# Altium schematic sheet lab2_larionov_buck.SchDoc: =title_line_1 + title_line_2
size 594 x 420 mm; SheetNumber: 1
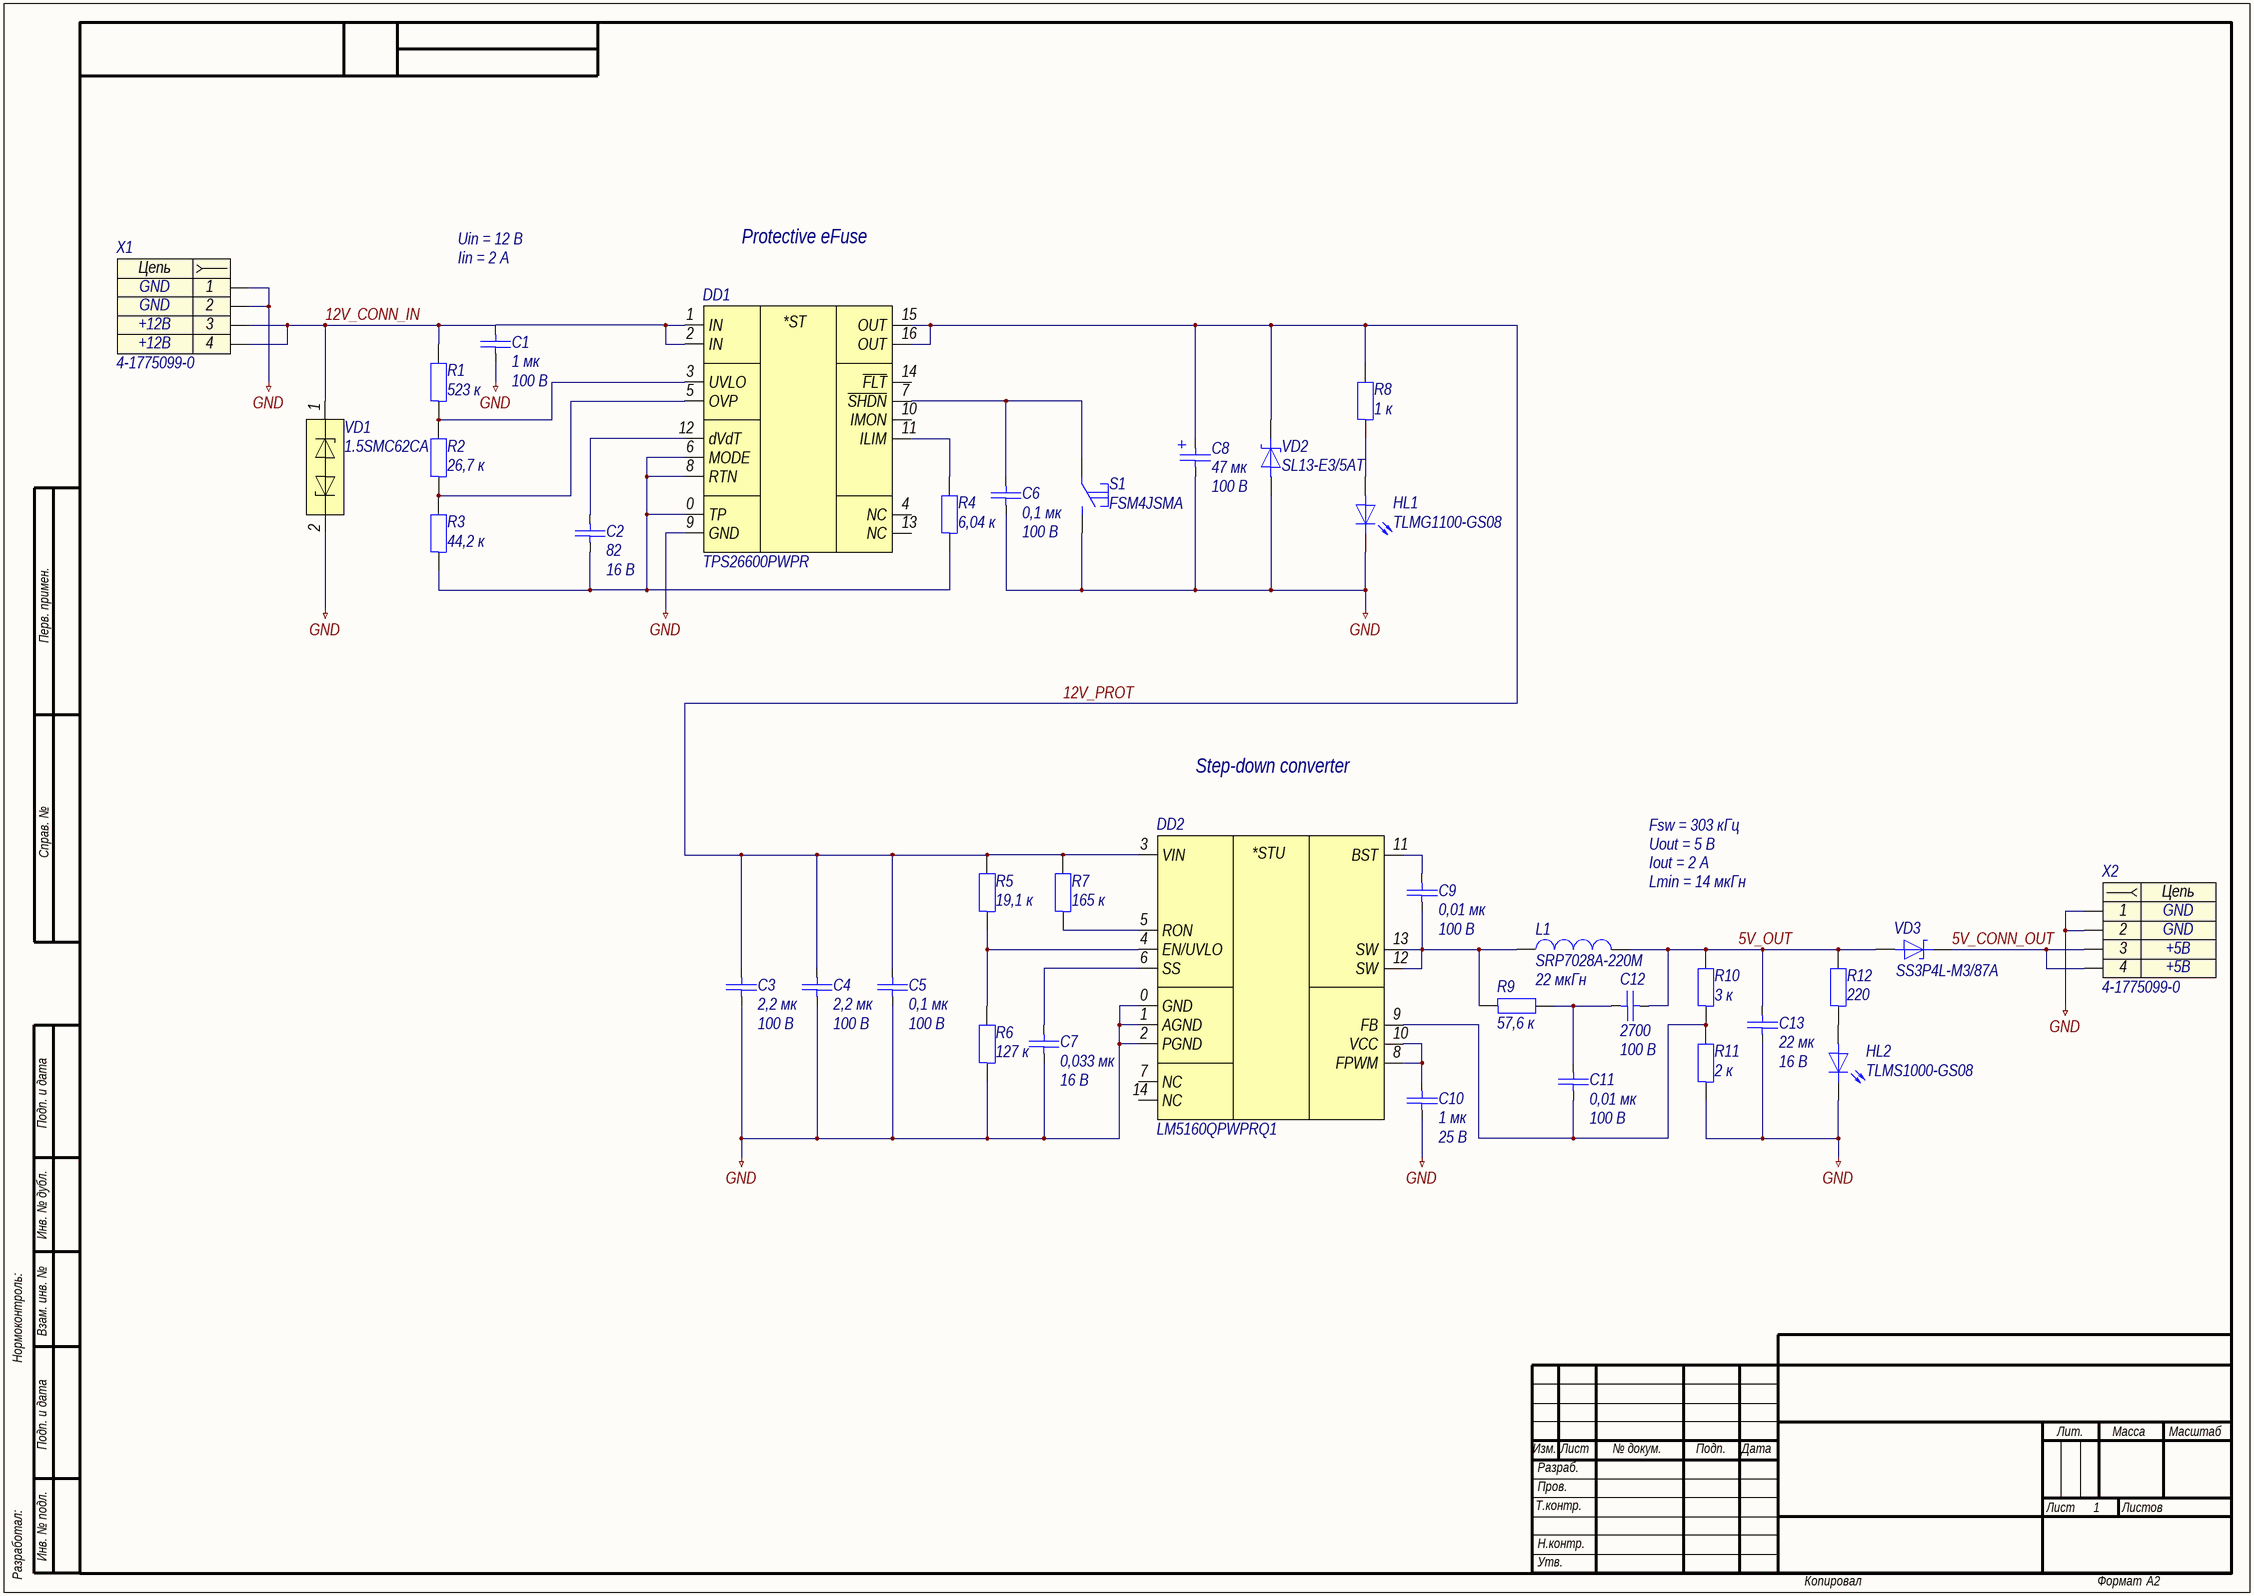
[diagram p0: lab2_larionov_buck.SchDoc]

## Parts
C1  1 мк  Напряжение: 100 В  [C1206]
C2  82  Напряжение: 16 В  [C0603]
C3  2,2 мк  Напряжение: 100 В  [C1206]
C4  2,2 мк  Напряжение: 100 В  [C1206]
C5  0,1 мк  Напряжение: 100 В  [C0603]
C6  0,1 мк  Напряжение: 100 В  [C0603]
C7  0,033 мк  Напряжение: 16 В  [C0603]
C8  47 мк  Напряжение: 100 В  [CAPAE-1000X1000X1200]
C9  0,01 мк  Напряжение: 100 В  [C0603]
C10  1 мк  Напряжение: 25 В  [C0603]
C11  0,01 мк  Напряжение: 100 В  [C0603]
C12  2700  Напряжение: 100 В  [C0603]
C13  22 мк  Напряжение: 16 В  [C1206]
DD1  TPS26600PWPR  [HTSSOP-16]
DD2  LM5160QPWPRQ1  [HTSSOP-14]
HL1  TLMG1100-GS08  [HL0603]
HL2  TLMS1000-GS08  [HL0603]
L1  SRP7028A-220M  Индуктивность: 22 мкГн  [SRP-2-670X660X280]
R1  523 к  [R0603]
R2  26,7 к  [R0603]
R3  44,2 к  [R0603]
R4  6,04 к  [R0603]
R5  19,1 к  [R0603]
R6  127 к  [R0603]
R7  165 к  [R0603]
R8  1 к  [R1218]
R9  57,6 к  [R0603]
R10  3 к  [R0603]
R11  2 к  [R0603]
R12  220  [R0603]
S1  FSM4JSMA  [FSM4JSMA]
VD1  1.5SMC62CA  [DO-214AB]
VD2  SL13-E3/5AT  [DO-214AC]
VD3  SS3P4L-M3/87A  [TO-277A]
X1  4-1775099-0  [4-1775099-0]
X2  4-1775099-0  [4-1775099-0]

## Nets
GND: C1.2 C3.2 C4.2 C5.2 C6.2 C7.2 C8.2 C10.2 C13.2 DD1.9(GND) DD2.0(GND) DD2.1(AGND) DD2.2(PGND) HL1.1 HL2.1 R6.1 R11.1 S1.2 VD1.2 VD2.2 X1.1 X1.2 X2.1 X2.2
5V_CONN_OUT: VD3.1 X2.3 X2.4
5V_OUT: C12.1 C13.1 L1.2 R10.2 R12.2 VD3.2
12V_CONN_IN: C1.1 DD1.1(IN) DD1.2(IN) R1.2 VD1.1 X1.3 X1.4
12V_PROT: C3.1 C4.1 C5.1 C8.1 DD1.15(OUT) DD1.16(OUT) DD2.3(VIN) R5.2 R7.2 R8.2 VD2.1
NetC2_1: C2.1 DD1.12(dVdT)
NetC2_2: C2.2 DD1.0(TP) DD1.6(MODE) DD1.8(RTN) R3.1 R4.1
NetC6_1: C6.1 DD1.7(~{SHDN}) S1.1
NetC7_1: C7.1 DD2.6(SS)
NetC9_1: C9.1 DD2.11(BST)
NetC9_2: C9.2 DD2.12(SW) DD2.13(SW) L1.1 R9.1
NetC10_1: C10.1 DD2.8(FPWM) DD2.10(VCC)
NetC11_1: C11.1 C12.2 R9.2
NetC11_2: C11.2 DD2.9(FB) R10.1 R11.2
NetDD1_3: DD1.3(UVLO) R1.1 R2.2
NetDD1_5: DD1.5(OVP) R2.1 R3.2
NetDD1_11: DD1.11(ILIM) R4.2
NetDD2_4: DD2.4(EN/UVLO) R5.1 R6.2
NetDD2_5: DD2.5(RON) R7.1
NetHL1_2: HL1.2 R8.1
NetHL2_2: HL2.2 R12.1

Not connected (* = marked no-connect by the designer): DD1 4(NC) 10(IMON) 13(NC) 14(~{FLT}); DD2 7(NC) 14(NC)

## Notes on the sheet
- Uin = 12 В
- Iin = 2 А
- Protective eFuse
- Step-down converter
- Fsw = 303 кГц
- Uout = 5 В
- Iout = 2 А
- Lmin = 14 мкГн
- Перв. примен.
- Справ. №
- Подп. и дата
- Инв. № дубл.
- Нормоконтроль:
- Взам. инв. №
- Изм.
- Лист
- № докум.
- Подп.
- Дата
- Лит.
- Масса
- Масштаб
- Т.контр.
- Пров.
- Разраб.
- Листов
- Разработал:
- Инв. № подл.
- Н.контр.
- Утв.
- Копировал
- Формат
- А2
- (in symbol dd0001) *ST
- (in symbol dd0003) *STU
- (in symbol x0004) Цепь

## Library data of the parts
C1 = c0068: =Описание; ID: c0068; Фамилия: Ларионов; Описание: Конденсатор чип 1206 1 мкФ 100 В ±10 %; Наименование: CC1206KKX7R0BB105; Производитель: YAGEO Corp.; Отклонение: ±10 %; Рабочие температуры: от –55 °С до +125 °С; Температурный коэффициент емкости: X7R; Корпус: 1206; Номинал: 1 мк; Номинальное напряжение: 100 В; HelpURL: https://www.yageo.com/upload/media/product/productsearch/datasheet/mlcc/UPY-NP0X7R_MV_100-to-630V_22.pdf
C2 = c0011: =Описание; ID: c0011; Фамилия: Ларионов; Описание: Конденсатор чип 0603 82 пФ 16 В ±5 %; Наименование: CC0603JRNPO7BN820; Производитель: YAGEO Corp.; Отклонение: ±5 %; Рабочие температуры: от –55 °С до +125 °С; Температурный коэффициент емкости: C0G; Корпус: 0603; Номинал: 82; Номинальное напряжение: 16 В; HelpURL: https://www.yageo.com/upload/media/product/productsearch/datasheet/mlcc/UPY-GP_NP0_16V-to-50V_18.pdf
C3 C4 = c0078: =Описание; ID: c0078; Фамилия: Ларионов; Описание: Конденсатор чип 1206 2,2 мкФ 100 В ±10 %; Наименование: CC1206KKX7R0BB225; Производитель: YAGEO Corp.; Отклонение: ±10 %; Рабочие температуры: от –55 °С до +125 °С; Температурный коэффициент емкости: X7R; Корпус: 1206; Номинал: 2,2 мк; Номинальное напряжение: 100 В; HelpURL: https://www.yageo.com/upload/media/product/productsearch/datasheet/mlcc/UPY-NP0X7R_MV_100-to-630V_22.pdf
C5 C6 = c0038: =Описание; ID: c0038; Фамилия: Ларионов; Описание: Конденсатор чип 0603 100 нФ 100 В ±10 %; Наименование: CC0603KRX7R0BB104; Производитель: YAGEO Corp.; Отклонение: ±10 %; Рабочие температуры: от –55 °С до +125 °С; Температурный коэффициент емкости: X7R; Корпус: 0603; Номинал: 0,1 мк; Номинальное напряжение: 100 В; HelpURL: https://www.yageo.com/upload/media/product/productsearch/datasheet/mlcc/UPY-NP0X7R_MV_100-to-630V_22.pdf
C7 = c0027: =Описание; ID: c0027; Фамилия: Ларионов; Описание: Конденсатор чип 0603 33 нФ 16 В ±5 %; Наименование: CC0603JPX7R7BB333; Производитель: YAGEO Corp.; Отклонение: ±5 %; Рабочие температуры: от –55 °С до +125 °С; Температурный коэффициент емкости: X7R; Корпус: 0603; Номинал: 0,033 мк; Номинальное напряжение: 16 В; HelpURL: https://www.yageo.com/upload/media/product/productsearch/datasheet/mlcc/UPY-GPHC_X7R_6.3V-to-50V_20.pdf
C8 = c0118: =Описание; ID: c0118; Фамилия: Ларионов; Описание: Конденсатор электролитический 47 мкФ 100 В ±20 %; Наименование: MAL214699904E3; Производитель: Vishay Intertechnology, Inc.; Отклонение: ±20 %; Рабочие температуры: от –55 °С до +125 °С; Корпус: CAPAE (10 x 10 x 12); Номинал: 47 мк; Номинальное напряжение: 100 В; Температурный коэффициент емкости: -; HelpURL: https://www.vishay.com/capacitors/list/product-28403/
C9 C11 = c0022: =Описание; ID: c0022; Фамилия: Ларионов; Описание: Конденсатор чип 0603 10 нФ 100 В ±5 %; Наименование: CC0603JRX7R0BB103; Производитель: YAGEO Corp.; Отклонение: ±5 %; Рабочие температуры: от –55 °С до +125 °С; Температурный коэффициент емкости: X7R; Корпус: 0603; Номинал: 0,01 мк; Номинальное напряжение: 100 В; HelpURL: https://www.yageo.com/upload/media/product/productsearch/datasheet/mlcc/UPY-NP0X7R_MV_100-to-630V_22.pdf
C10 = c0017: =Описание; ID: c0017; Фамилия: Ларионов; Описание: Конденсатор чип 0603 1 мкФ 25 В ±10 %; Наименование: CC0603KRX7R8BB105; Производитель: YAGEO Corp.; Отклонение: ±10 %; Рабочие температуры: от -55 °С до +125 °С; Корпус: 0603; Номинал: 1 мк; Номинальное напряжение: 25 В; HelpURL: https://www.yageo.com/upload/media/product/products/datasheet/mlcc/UPY-GPHC_X7R_6.3V-to-50V_20.pdf
C12 = c0021: =Описание; ID: c0021; Фамилия: Ларионов; Описание: Конденсатор чип 0603 2,7 нФ 100 В ±10 %; Наименование: CC0603KRX7R0BB272; Производитель: YAGEO Corp.; Отклонение: ±10 %; Рабочие температуры: от –55 °С до +125 °С; Температурный коэффициент емкости: X7R; Корпус: 0603; Номинал: 2700; Номинальное напряжение: 100 В; HelpURL: https://www.yageo.com/upload/media/product/products/datasheet/mlcc/UPY-GPHC_X7R_6.3V-to-50V_20.pdf
C13 = c0106: =Описание; ID: c0106; Фамилия: Ларионов; Описание: Конденсатор чип 1206 22 мкФ 16 В ±20 %; Наименование: CC1206MKX7R7BB226; Производитель: YAGEO Corp.; Отклонение: ±20 %; Рабочие температуры: от –55 °С до +125 °С; Температурный коэффициент емкости: X7R; Корпус: 1206; Номинал: 22 мк; Номинальное напряжение: 16 В; HelpURL: https://www.yageo.com/upload/media/product/productsearch/datasheet/mlcc/UPY-GPHC_X7R_6.3V-to-50V_20.pdf
DD1 = dd0001: =Описание; ID: dd0001; Фамилия: Ларионов; Описание: Защитная микросхема eFuse 60 В и 2 А; Производитель: Texas Instruments; Напряжение: от 4,2 В до 60 В; Максимальное напряжение: 62 В; Ток: от 0,1 А до 2,23 А; Рабочие температуры: от -40 °С до +125 °С; Наименование: TPS26600PWPR; Корпус: HTSSOP-16; HelpURL: https://www.ti.com/product/TPS2660
DD2 = dd0003: =Описание; ID: dd0003; Фамилия: Ларионов; Описание: Понижающий преобразователь напряжения 65 В и 2 А; Производитель: Texas Instruments; Входное напряжение: от 4,5 В до 65 В; Выходное напряжение: не указано; Коммутируемый ток: до 2 А; Частота переключения: до 1 МГц; Рабочие температуры: от -40 °С до +125 °С; Наименование: LM5160QPWPRQ1; Корпус: HTSSOP-14; HelpURL: https://www.ti.com/product/LM5160-Q1
HL1 = hl0005: =Описание; ID: hl0005; Фамилия: Ларионов; Описание: Светодиод чип 0603 зеленый; Производитель: Vishay Intertechnology, Inc.; Цвет: Green; Номинальная сила света: 35 мкд; Номинальная длина волны: 570 нм; Номинальный прямой ток: 30 мА; Номинальное падение напряжения: 2,1 В; Рассеиваемая мощность: 90 мВт; Рабочие температуры: от -40 °С до +100 °С; Корпус: 0603; Наименование: TLMG1100-GS08; HelpURL: https://www.vishay.com/leds/list/product-83173/
HL2 = hl0001: =Описание; ID: hl0001; Фамилия: Ларионов; Описание: Светодиод чип 0603 красный; Производитель: Vishay Intertechnology, Inc.; Цвет: Red; Номинальная сила света: 4 мкд; Номинальная длина волны: 628 нм; Номинальный прямой ток: 15 мА; Номинальное падение напряжения: 1,8 В; Рассеиваемая мощность: 40 мВт; Рабочие температуры: от -40 °С до +100 °С; Корпус: 0603; Наименование: TLMS1000-GS08; HelpURL: https://www.vishay.com/leds/list/product-83172/
L1 = l0006: =Описание; ID: l0006; Фамилия: Ларионов; Описание: Катушка индуктивности 22 мкГн ±20 %; Производитель: Bourns, Inc.; Отклонение: ±20 %; Номинальное активное сопротивление: 165 мОм; Максимальное активное сопротивление: 190 мОм; Резонансная частота: 10 МГц; Номинальный ток (при нагреве на 20 °С/40 °С): 2 А; Ток насыщения: 3,5 А; Рабочее напряжение: не указано; Рабочие температуры: от –55 °С до +150 °С; Корпус: 6,7 x 6,6 x 2,8; Наименование: SRP7028A-220M; Номинал: 22 мкГн; HelpURL: https://www.bourns.com/products/magnetic-products/power-inductors-aec-q200-compliant/product/SRP7028A
R1 = r0032: =Описание; ID: r0032; Фамилия: Жернаков; Описание: Резистор чип 0603 523 кОм ±1 % 0,1 Вт; Наименование: RC0603FR-07523KL; Производитель: YAGEO Corp.; Отклонение: ±1 %; Номинальное напряжение: 75 В; Рабочие температуры: от -55 °С до +155 °С; Номинальный ток: 1 А; Корпус: 0603; Номинал: 523 к; HelpURL: https://www.yageo.com/upload/media/product/productsearch/datasheet/rchip/PYu-RC_Group_51_RoHS_L_11.pdf
R2 = r0022: =Описание; ID: r0022; Фамилия: Ларионов; Описание: Резистор чип 0603 26,7 кОм ±1 % 0,1 Вт; Наименование: RC0603FR-0726K7L; Производитель: YAGEO Corp.; Отклонение: ±1 %; Номинальное напряжение: 75 В; Рабочие температуры: от -55 °С до +155 °С; Номинальный ток: 1 А; Корпус: 0603; Номинал: 26,7 к; HelpURL: https://www.yageo.com/upload/media/product/productsearch/datasheet/rchip/PYu-RC_Group_51_RoHS_L_11.pdf
R3 = r0023: =Описание; ID: r0023; Фамилия: Ларионов; Описание: Резистор чип 0603 44,2 кОм ±1 % 0,1 Вт; Наименование: RC0603FR-0744K2L; Производитель: YAGEO Corp.; Отклонение: ±1 %; Номинальное напряжение: 75 В; Рабочие температуры: от -55 °С до +155 °С; Номинальный ток: 1 А; Корпус: 0603; Номинал: 44,2 к; HelpURL: https://www.yageo.com/upload/media/product/productsearch/datasheet/rchip/PYu-RC_Group_51_RoHS_L_11.pdf
R4 = r0015: =Описание; ID: r0015; Фамилия: Ларионов; Описание: Резистор чип 0603 6,04 кОм ±1 % 0,1 Вт; Наименование: RC0603FR-076K04L; Производитель: YAGEO Corp.; Отклонение: ±1 %; Номинальное напряжение: 75 В; Рабочие температуры: от -55 °С до +155 °С; Номинальный ток: 1 А; Корпус: 0603; Номинал: 6,04 к; HelpURL: https://www.yageo.com/upload/media/product/productsearch/datasheet/rchip/PYu-RC_Group_51_RoHS_L_11.pdf
R5 = r0020: =Описание; ID: r0020; Фамилия: Ларионов; Описание: Резистор чип 0603 19,1 кОм ±1 % 0,1 Вт; Наименование: RC0603FR-0719K1L; Производитель: YAGEO Corp.; Отклонение: ±1 %; Номинальное напряжение: 75 В; Рабочие температуры: от -55 °С до +155 °С; Номинальный ток: 1 А; Корпус: 0603; Номинал: 19,1 к; HelpURL: https://www.yageo.com/upload/media/product/productsearch/datasheet/rchip/PYu-RC_Group_51_RoHS_L_11.pdf
R6 = r0028: =Описание; ID: r0028; Фамилия: Ларионов; Описание: Резистор чип 0603 127 кОм ±1 % 0,1 Вт; Наименование: RC0603FR-07127KL; Производитель: YAGEO Corp.; Отклонение: ±1 %; Номинальное напряжение: 75 В; Рабочие температуры: от -55 °С до +155 °С; Номинальный ток: 1 А; Корпус: 0603; Номинал: 127 к; HelpURL: https://www.yageo.com/upload/media/product/productsearch/datasheet/rchip/PYu-RC_Group_51_RoHS_L_11.pdf
R7 = r0030: =Описание; ID: r0030; Фамилия: Ларионов; Описание: Резистор чип 0603 165 кОм ±1 % 0,1 Вт; Наименование: RC0603FR-07165KL; Производитель: YAGEO Corp.; Отклонение: ±1 %; Номинальное напряжение: 75 В; Рабочие температуры: от -55 °С до +155 °С; Номинальный ток: 1 А; Корпус: 0603; Номинал: 165 к; HelpURL: https://www.yageo.com/upload/media/product/productsearch/datasheet/rchip/PYu-RC_Group_51_RoHS_L_11.pdf
R8 = r0012: =Описание; ID: r0012; Фамилия: Ларионов; Описание: Резистор чип 1218 1 кОм ±1 % 1 Вт; Наименование: AA1218FK-071KL; Производитель: YAGEO Corp.; Отклонение: ±1 %; Номинальное напряжение: 200 В; Рабочие температуры: от -55 °С до +155 °С; Номинальный ток: 6 А; Корпус: 1218; Номинал: 1 к; HelpURL: https://www.yageo.com/upload/media/product/productsearch/datasheet/rchip/PYu-AA_51_RoHS_L_3.pdf
R9 = r0025: =Описание; ID: r0025; Фамилия: Ларионов; Описание: Резистор чип 0603 57,6 кОм ±1 % 0,1 Вт; Наименование: RC0603FR-0757K6L; Производитель: YAGEO Corp.; Отклонение: ±1 %; Номинальное напряжение: 75 В; Рабочие температуры: от -55 °С до +155 °С; Номинальный ток: 1 А; Корпус: 0603; Номинал: 57,6 к; HelpURL: https://www.yageo.com/upload/media/product/productsearch/datasheet/rchip/PYu-RC_Group_51_RoHS_L_11.pdf
R10 = r0013: =Описание; ID: r0013; Фамилия: Ларионов; Описание: Резистор чип 0603 3 кОм ±1 % 0,1 Вт; Наименование: RC0603FR-073KL; Производитель: YAGEO Corp.; Отклонение: ±1 %; Номинальное напряжение: 75 В; Рабочие температуры: от -55 °С до +155 °С; Номинальный ток: 1 А; Корпус: 0603; Номинал: 3 к; HelpURL: https://www.yageo.com/upload/media/product/productsearch/datasheet/rchip/PYu-RC_Group_51_RoHS_L_11.pdf
R11 = r0013: =Описание; ID: r0013; Фамилия: Ларионов; Описание: Резистор чип 0603 2 кОм ±1 % 0,1 Вт; Наименование: RC0603FR-072KL; Производитель: YAGEO Corp.; Отклонение: ±1 %; Номинальное напряжение: 75 В; Рабочие температуры: от -55 °С до +155 °С; Номинальный ток: 1 А; Корпус: 0603; Номинал: 2 к; HelpURL: https://www.yageo.com/upload/media/product/productsearch/datasheet/rchip/PYu-RC_Group_51_RoHS_L_11.pdf
R12 = r0009: =Описание; ID: r0009; Фамилия: Ларионов; Описание: Резистор чип 0603 220 Ом ±1 % 0,1 Вт; Наименование: RC0603FR-07220RL; Производитель: YAGEO Corp.; Отклонение: ±1 %; Номинальное напряжение: 75 В; Рабочие температуры: от -55 °С до +155 °С; Номинальный ток: 1 А; Корпус: 0603; Номинал: 220; HelpURL: https://www.yageo.com/upload/media/product/productsearch/datasheet/rchip/PYu-RC_Group_51_RoHS_L_11.pdf
S1 = sw0002: =Описание; ID: sw0002; Фамилия: Паньков; Описание: Тактовая кнопка поверхностного монтажа; Производитель: TE Connectivity; Ток нагрузки: 50 мА @ 24 В; Сопротивление контакта: 100 мОм; Количество контактов: 1; Рабочие температуры: от -35 °С до +85 °С; Промывка: Разрешена; Корпус: 6,00x6,00x4,98; Наименование: FSM4JSMA; HelpURL: https://www.te.com/usa-en/product-4-1437565-1.html
VD1 = vd0004: =Описание; ID: vd0004; Фамилия: Ларионов; Описание: Двунаправленная диодная сборка для подавления помех, 53 В; Производитель: Littelfuse, Inc.; Наименование: 1.5SMC62CA; Корпус: DO-214AB; HelpURL: https://www.littelfuse.com/products/tvs-diodes/surface-mount/1_5smc.aspx
VD2 = vd0001: =Описание; ID: vd0001; Фамилия: Ларионов; Описание: Диод Шоттки 30 В 1,5 А; Производитель: Vishay Intertechnology, Inc.; Пиковое прямое напряжение: 0,445 В; Импульсное обратное напряжение: 30 В; Макс допустимый средний прямой ток: 1,5 А; Рабочие температуры: от -55 °С до +125 °С; Наименование: SL13-E3/5AT; Корпус: DO-214AC; HelpURL: https://www.vishay.com/product?docid=88740
VD3 = vd0002: =Описание; ID: vd0002; Фамилия: Ларионов; Описание: Диод Шоттки 40 В 3 А; Производитель: Vishay Intertechnology, Inc.; Пиковое прямое напряжение: 0,47 В; Импульсное обратное напряжение: 40 В; Макс допустимый средний прямой ток: 3 А; Рабочие температуры: от -55 °С до +150 °С; Наименование: SS3P4L-M3/87A; Корпус: TO-277A; HelpURL: https://www.vishay.com/diodes/list/product-88986/
X1 = x0004: =Описание; Contact_1: GND; Contact_3: +12В; ID: x0004; Фамилия: Ларионов; Описание: ATX Power 4 pin гнездо прямой; Производитель: TE Connectivity; Contact_2: GND; Contact_4: +12В; Наименование: 4-1775099-0; HelpURL: https://www.te.com/usa-en/product-4-1775099-0.html
X2 = x0004: =Описание; Contact_1: GND; Contact_3: +5В; ID: x0004; Фамилия: Ларионов; Описание: ATX Power 4 pin гнездо прямой; Производитель: TE Connectivity; Contact_2: GND; Contact_4: +5В; Наименование: 4-1775099-0; HelpURL: https://www.te.com/usa-en/product-4-1775099-0.html